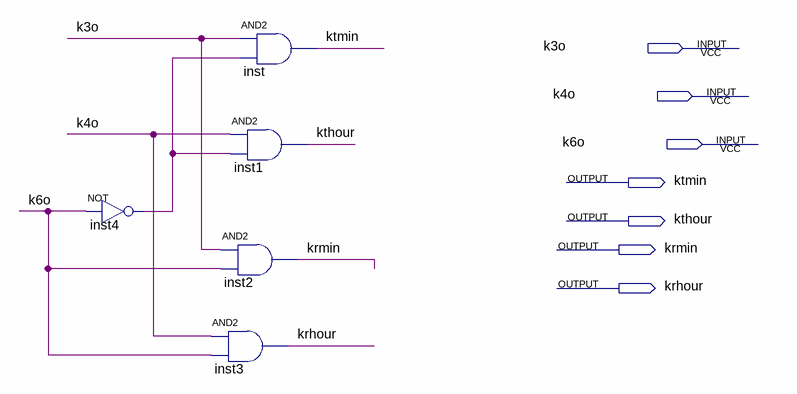
[diagram p0: schematic sheet]
// Quartus schematic kaiguanfuyong1.bdf as structural Verilog: 5 symbols, 7 pins
module kaiguanfuyong1 (
  input  k3o,
  input  k4o,
  input  k6o,
  output ktmin,
  output kthour,
  output krmin,
  output krhour
);

  wire inst4_out;

  not inst4 (inst4_out, k6o);
  and inst2 (krmin, k3o, k6o);
  and inst3 (krhour, k4o, k6o);
  and inst (ktmin, k3o, inst4_out);
  and inst1 (kthour, k4o, inst4_out);
endmodule
